# Altium schematic sheet Banks_3_4.SchDoc: FPGA Motherboard for Digital Multiplexed Readout, McGill U.
size B; DocumentNumber: DfMUX3; Revision: Rev0, Prototype; SheetNumber: 3; SheetTotal: 27; PageSetup: Record=PageOptions|CenterHorizontal=True|CenterVertical=True|PrintScale=1.08|XCorrection=1.00|YCorrection=1.00|PrintKind=0|BorderSize=5000000|LeftOffset=0|BottomOffset=0|Orientation=2|PaperLength=1000|PaperWidth=1000|Scale=100|PaperSource=7|PrintQuality=-4|MediaType=1|DitherType=10|PaperKind=Tabloid|PrintScaleMode=1
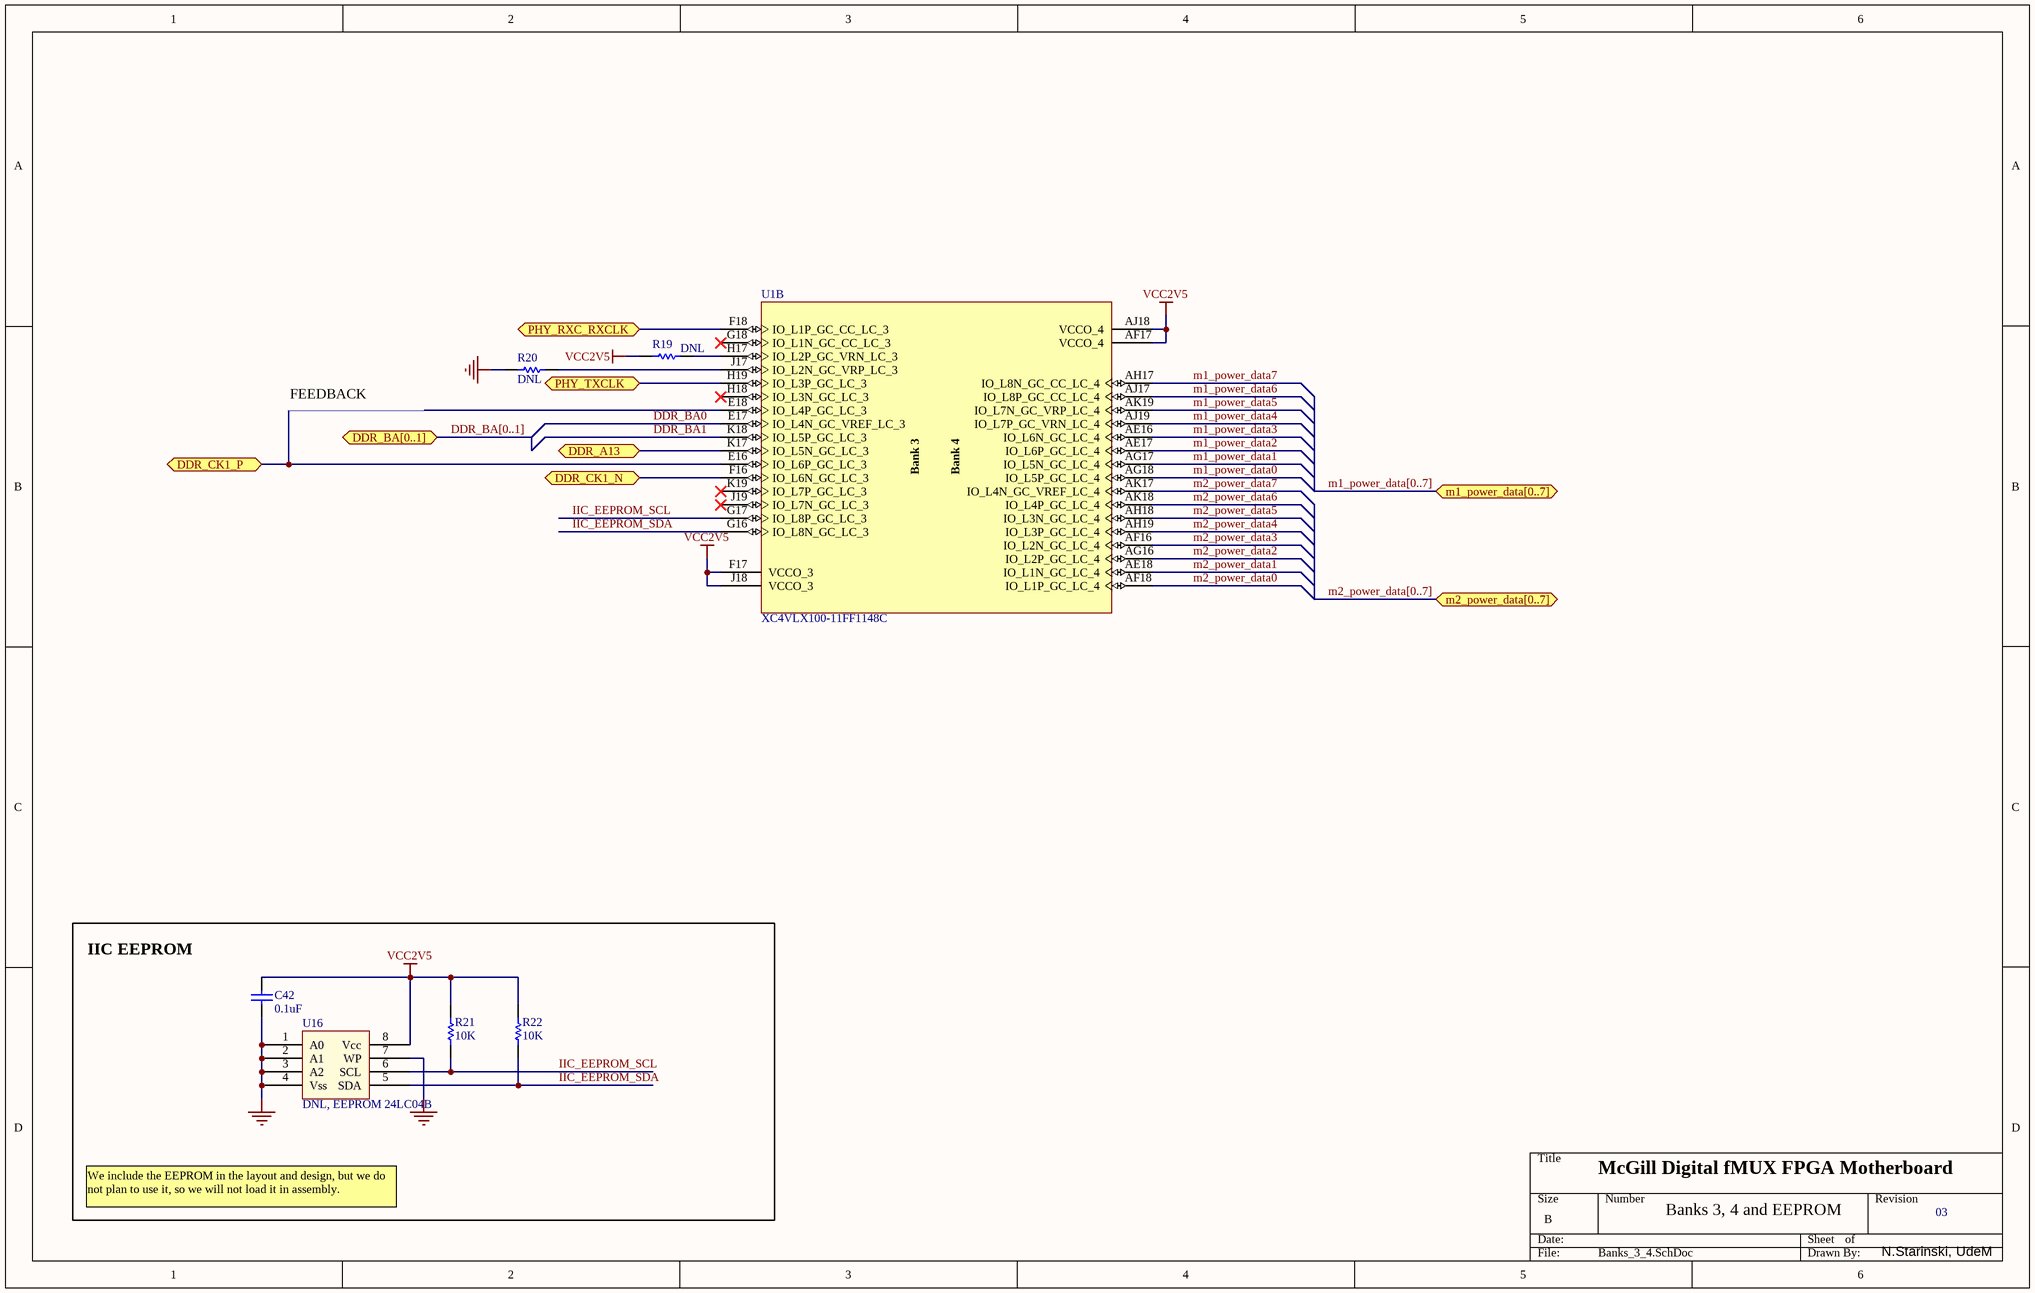
[diagram p0: Banks_3_4.SchDoc]

## Parts
C42  0.1uF  [CC1608-0603]
R19  DNL  [CR1608-0603]
R20  DNL  [CR1608-0603]
R21  10K  [CR1608-0603]
R22  10K  [CR1608-0603]
U1  XC4VLX100-11FF1148C  [FF1148]  (part B of 10)
U16  DNL, EEPROM 24LC04B  [TSSOP8-4.4]

## Ports
DDR_A13 (bidir), DDR_BA[0..1] (bidir), DDR_CK1_N (bidir), DDR_CK1_P (bidir), m1_power_data[0..7], m2_power_data[0..7] (bidir), PHY_RXC_RXCLK (bidir), PHY_TXCLK (bidir)

## Nets
GND: C42.1 R20.1 U16.1(A0) U16.2(A1) U16.3(A2) U16.4(Vss) U16.7(WP)
VCC2V5: C42.2 R19.1 R21.2 R22.2 U1.AF17(VCCO_4) U1.AJ18(VCCO_4) U1.F17(VCCO_3) U1.J18(VCCO_3) U16.8(Vcc)
DDR_A13: U1.K17(IO_L5N_GC_LC_3) ; port DDR_A13
DDR_BA0: U1.E17(IO_L4N_GC_VREF_LC_3)
DDR_BA1: U1.K18(IO_L5P_GC_LC_3)
DDR_CK1_N: U1.F16(IO_L6N_GC_LC_3) ; port DDR_CK1_N
DDR_CK1_P: U1.E16(IO_L6P_GC_LC_3) U1.E18(IO_L4P_GC_LC_3) ; port DDR_CK1_P
IIC_EEPROM_SCL: R21.1 U1.G17(IO_L8P_GC_LC_3) U16.6(SCL)
IIC_EEPROM_SDA: R22.1 U1.G16(IO_L8N_GC_LC_3) U16.5(SDA)
m1_power_data0: U1.AG18(IO_L5P_GC_LC_4)
m1_power_data1: U1.AG17(IO_L5N_GC_LC_4)
m1_power_data2: U1.AE17(IO_L6P_GC_LC_4)
m1_power_data3: U1.AE16(IO_L6N_GC_LC_4)
m1_power_data4: U1.AJ19(IO_L7P_GC_VRN_LC_4)
m1_power_data5: U1.AK19(IO_L7N_GC_VRP_LC_4)
m1_power_data6: U1.AJ17(IO_L8P_GC_CC_LC_4)
m1_power_data7: U1.AH17(IO_L8N_GC_CC_LC_4)
m2_power_data0: U1.AF18(IO_L1P_GC_LC_4)
m2_power_data1: U1.AE18(IO_L1N_GC_LC_4)
m2_power_data2: U1.AG16(IO_L2P_GC_LC_4)
m2_power_data3: U1.AF16(IO_L2N_GC_LC_4)
m2_power_data4: U1.AH19(IO_L3P_GC_LC_4)
m2_power_data5: U1.AH18(IO_L3N_GC_LC_4)
m2_power_data6: U1.AK18(IO_L4P_GC_LC_4)
m2_power_data7: U1.AK17(IO_L4N_GC_VREF_LC_4)
PHY_RXC_RXCLK: U1.F18(IO_L1P_GC_CC_LC_3) ; port PHY_RXC_RXCLK
PHY_TXCLK: U1.H19(IO_L3P_GC_LC_3) ; port PHY_TXCLK
NetR19_2: R19.2 U1.H17(IO_L2P_GC_VRN_LC_3)
NetR20_2: R20.2 U1.J17(IO_L2N_GC_VRP_LC_3)

Not connected (* = marked no-connect by the designer): U1 G18(IO_L1N_GC_CC_LC_3)* H18(IO_L3N_GC_LC_3)* J19(IO_L7N_GC_LC_3)* K19(IO_L7P_GC_LC_3)*

## Buses and harness runs
bus DDR_BA[0..1] = port DDR_BA[0..1]
bus m1_power_data[0..7] = port m1_power_data[0..7]
bus m2_power_data[0..7] = port m2_power_data[0..7]

## Notes on the sheet
- FEEDBACK
- (near C42) IIC EEPROM
- McGill Digital fMUX FPGA Motherboard
- We include the EEPROM in the layout and design, but we do not plan to use it, so we will not load it in assembly.
- Banks 3, 4 and EEPROM
- 03
- N.Starinski, UdeM
- (in symbol XC4VLX100-11FF1148C, part B) Bank 3; Bank 4

## Library data of the parts
C42 = Cap Semi: Capacitor (Semiconductor SIM Model); Published: 8-Jun-2000; LatestRevisionDate: 17-Jul-2002; LatestRevisionNote: Re-released for DXP Platform.; PackageReference: C1206; Publisher: Altium Limited
R19 R20 = Res Semi: Semiconductor Resistor; Published: 8-Jun-2000; LatestRevisionDate: 17-Jul-2002; LatestRevisionNote: Re-released for DXP Platform.; Publisher: Altium Limited
R21 R22 = Res Semi: Resistor 0603; Published: 8-Jun-2000; LatestRevisionDate: 17-Jul-2002; LatestRevisionNote: Re-released for DXP Platform.; Publisher: Altium Limited
U1 = XC4VLX100-11FF1148C: Xilinx Virtex-4 LX Platform FPGA, 1148-Ball FFBGA, Speed Grade 11, 768 User I/Os, Commercial Grade; PackageDocument: ver1.0, Oct-2002; Published: 13-Dec-2004; LatestRevisionDate: 4-Mar-2005; LatestRevisionNote: D_IN & CS_B pins changed from I/O to Input. DOUT_BUSY pin changed from I/O to Output.; DatasheetDocument: ver1.2, Dec-2004; PackageReference: FF1148; Publisher: Altium Limited; ComponentLink2Description: Virtex-4 Overview; ComponentLink2URL: http://www.xilinx.com/products/virtex4/overview.htm; ComponentLink3Description: Datasheet; ComponentLink3URL: http://direct.xilinx.com/bvdocs/userguides/ug075.pdf; Code_JEDEC: MS-034-AAR-1
U16 = 24AA04/24LC04B: 4K I2C Serial EEPROM